# Altium schematic sheet eElements.SchDoc
size A3; SheetNumber: 1; SheetTotal: 1
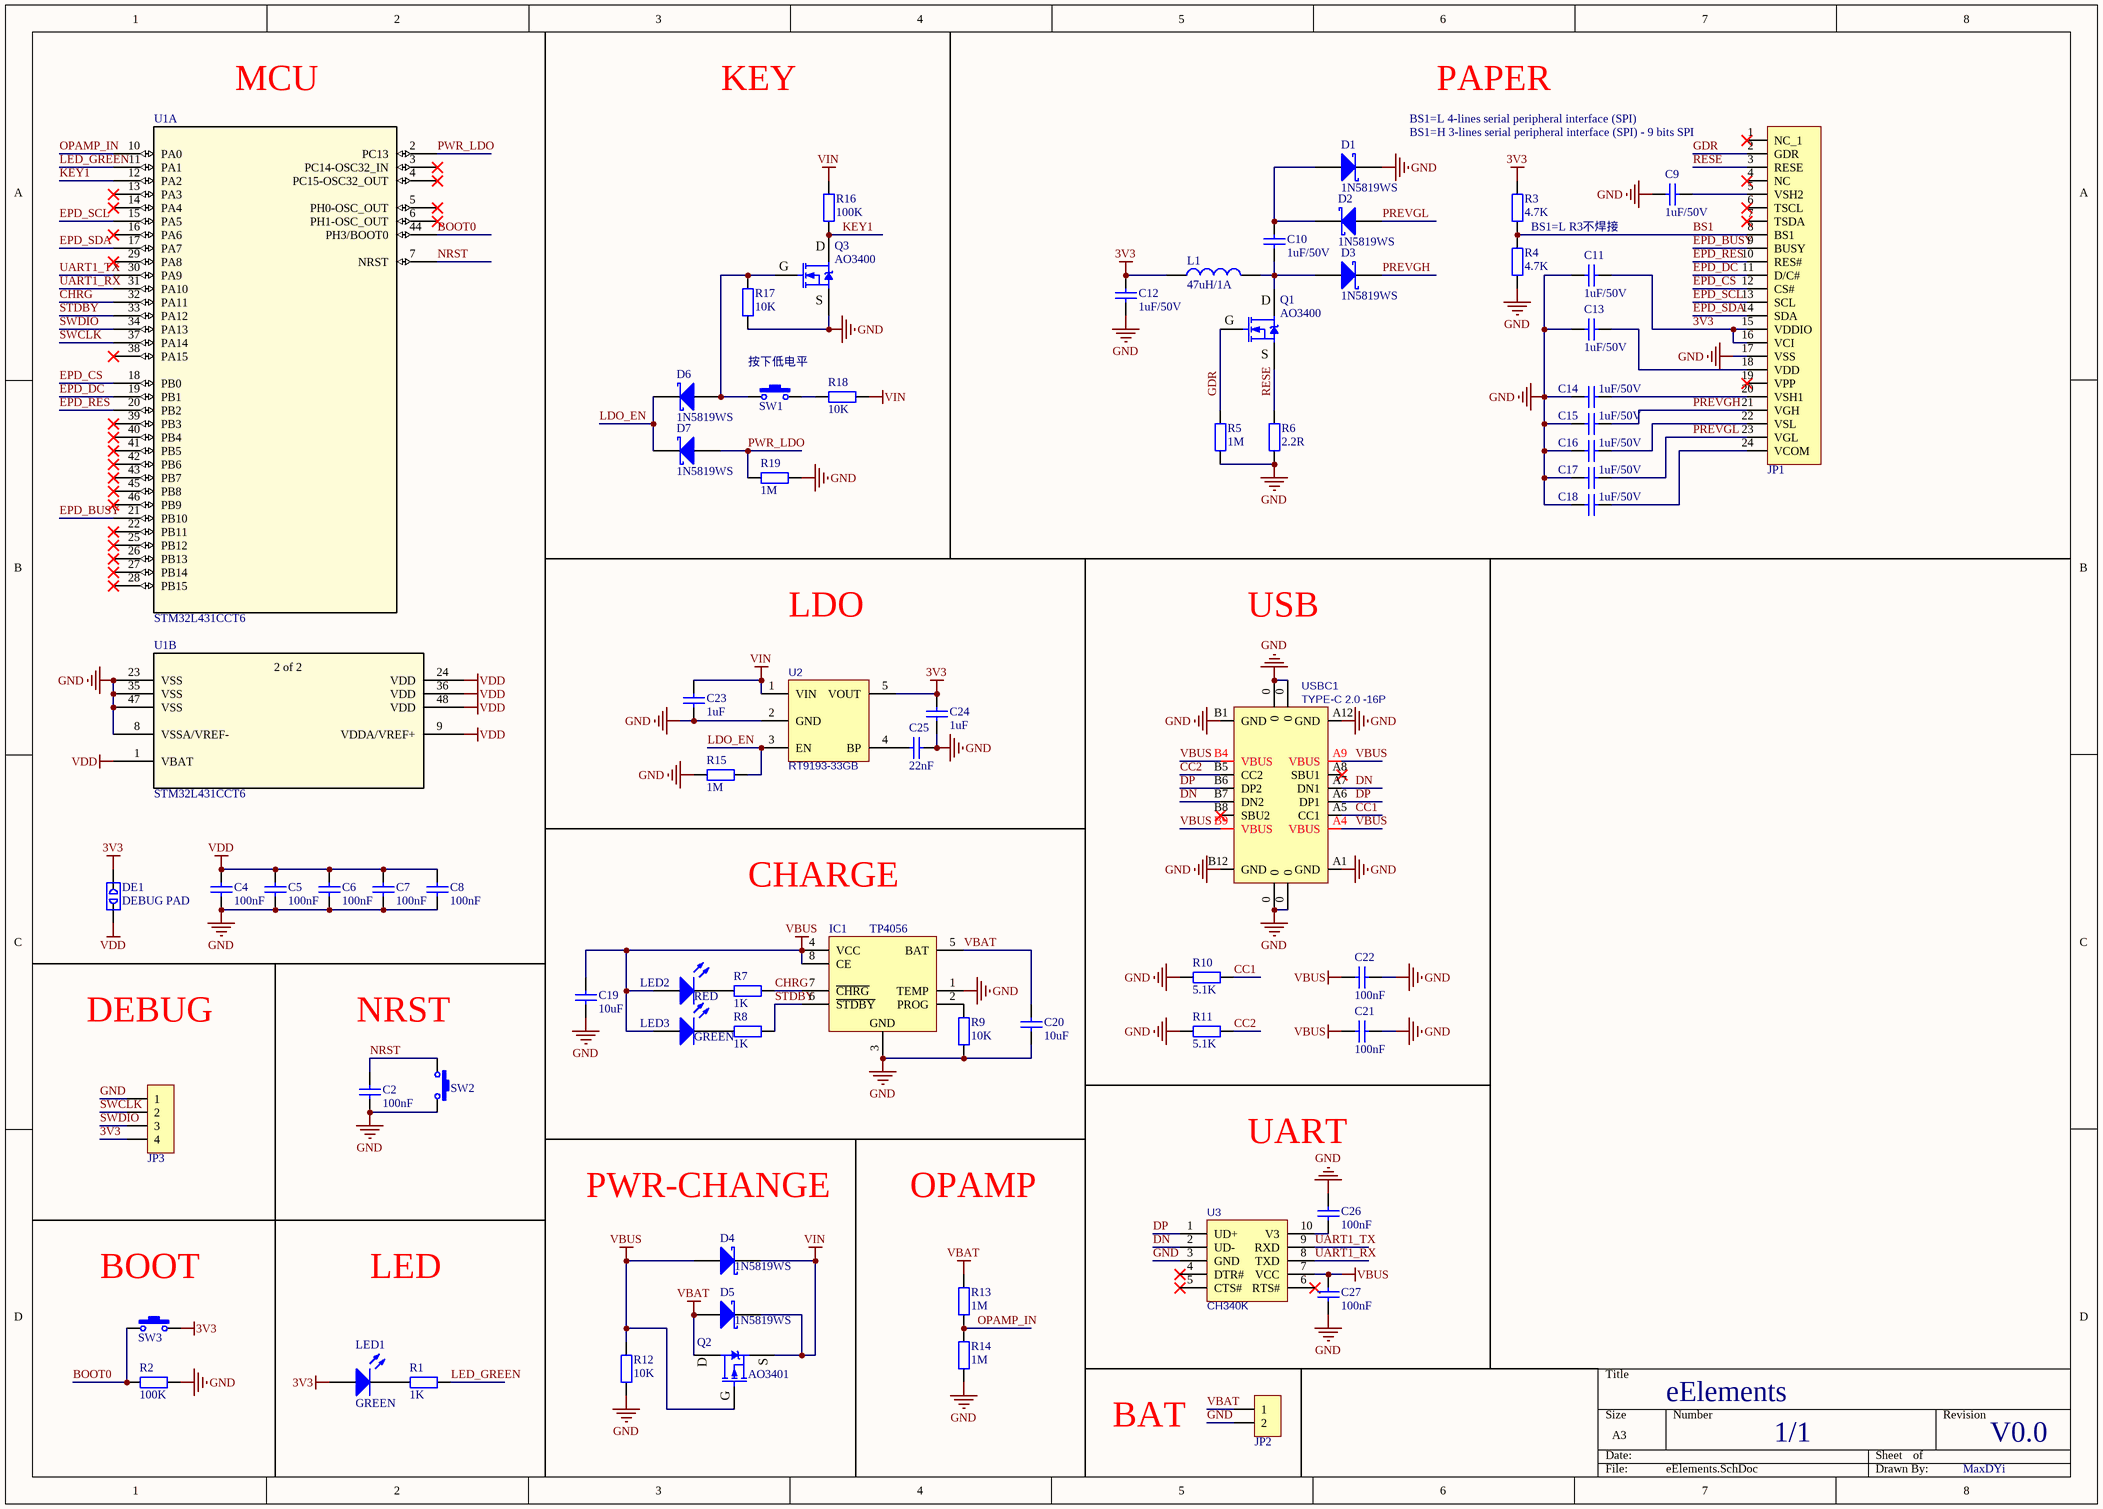
[diagram p0: eElements.SchDoc]

## Parts
C2  100nF  [C0402_M]
C4  100nF  [C0402_M]
C5  100nF  [C0402_M]
C6  100nF  [C0402_M]
C7  100nF  [C0402_M]
C8  100nF  [C0402_M]
C9  1uF/50V  [C0402_M]
C10  1uF/50V  [C0402_M]
C11  1uF/50V  [C0402_M]
C12  1uF/50V  [C0402_M]
C13  1uF/50V  [C0402_M]
C14  1uF/50V  [C0402_M]
C15  1uF/50V  [C0402_M]
C16  1uF/50V  [C0402_M]
C17  1uF/50V  [C0402_M]
C18  1uF/50V  [C0402_M]
C19  10uF  [C0402_M]
C20  10uF  [C0402_M]
C21  100nF  [C0402_M]
C22  100nF  [C0402_M]
C23  1uF  [C0402_M]
C24  1uF  [C0402_M]
C25  22nF  [C0402_M]
C26  100nF  [C0402_M]
C27  100nF  [C0402_M]
D1  1N5819WS  [SOD-323]
D2  1N5819WS  [SOD-323]
D3  1N5819WS  [SOD-323]
D4  1N5819WS  [SOD-323]
D5  1N5819WS  [SOD-323]
D6  1N5819WS  [SOD-323]
D7  1N5819WS  [SOD-323]
DE1  DEBUG PAD  [DEBUG_B]
IC1  TP4056  [SOIC-8_EP]
JP1  CON-24P  [FPC0.5-WT-24P-上接]  (value not drawn)
JP2  HDR-1X2  [MX1.25-W-2P]  (value not drawn)
JP3  HDR-1X4  [HDR1.27-LI-4P]  (value not drawn)
L1  47uH/1A  [SWPA4030]
LED1  GREEN  [LED0603_R]
LED2  RED  [LED0603_R]
LED3  GREEN  [LED0603_R]
Q1  AO3400  [SOT23-3N]
Q2  AO3401  [SOT23-3N]
Q3  AO3400  [SOT23-3N]
R1  1K  [R0402_M]
R2  100K  [R0402_M]
R3  4.7K  [R0402_M]
R4  4.7K  [R0402_M]
R5  1M  [R0402_M]
R6  2.2R  [R0603_M]
R7  1K  [R0402_M]
R8  1K  [R0402_M]
R9  10K  [R0402_M]
R10  5.1K  [R0402_M]
R11  5.1K  [R0402_M]
R12  10K  [R0402_M]
R13  1M  [R0402_M]
R14  1M  [R0402_M]
R15  1M  [R0402_M]
R16  100K  [R0402_M]
R17  10K  [R0402_M]
R18  10K  [R0402_M]
R19  1M  [R0402_M]
SW1  3x6x5  [SW 3*6*4.3-S-W]  (value not drawn)
SW2  3x6x5  [SW SMD-3*6*2.5]  (value not drawn)
SW3  3x6x5  [SW SMD-3*6*2.5]  (value not drawn)
U1  STM32L431CCT6  [LQFP48_M]  (parts A,B of 2)
U2  RT9193-33GB  [SOT-23-5]
U3  CH340K  [SOP10_M]
USBC1  TYPE-C 2.0 -16P  [USB-C-SMD_16P]

## Nets
3V3: C11.2 C12.2 C24.2 DE1.1 JP1.15(VDDIO) JP1.16(VCI) JP3.4 L1.1 LED1.1(A) R3.2 SW3.2 U2.5(VOUT)
GND: C2.1 C4.1 C5.1 C6.1 C7.1 C8.1 C9.1 C11.1 C12.1 C13.1 C14.1 C15.1 C16.1 C17.1 C18.1 C19.1 C20.1 C21.1 C22.1 C23.1 C24.1 C25.1 C26.2 C27.1 D1.2(K) IC1.1(TEMP) IC1.3(GND) JP1.17(VSS) JP2.2 JP3.1 Q3.2(S) R2.2 R4.1 R5.1 R6.1 R9.1 R10.2 R11.2 R12.2 R14.1 R15.2 R17.1 R19.1 SW2.2 U1.8(VSSA/VREF-) U1.23(VSS) U1.35(VSS) U1.47(VSS) U2.2(GND) U3.3(GND) USBC1.0 USBC1.A1(GND) USBC1.A12(GND) USBC1.B1(GND) USBC1.B12(GND)
VBAT: C20.2 D5.1(A) IC1.5(BAT) JP2.1 Q2.3(D) R13.2
VBUS: C19.2 C21.2 C22.2 C27.2 D4.1(A) IC1.4(VCC) IC1.8(CE) LED2.1(A) LED3.1(A) Q2.1(G) R12.1 U3.7(VCC) USBC1.A4(VBUS) USBC1.A9(VBUS) USBC1.B4(VBUS) USBC1.B9(VBUS)
VDD: C4.2 C5.2 C6.2 C7.2 C8.2 DE1.2 U1.1(VBAT) U1.9(VDDA/VREF+) U1.24(VDD) U1.36(VDD) U1.48(VDD)
VIN: C23.2 D4.2(K) D5.2(K) Q2.2(S) R16.2 R18.1 U2.1(VIN)
BOOT0: R2.1 SW3.1 U1.44(PH3/BOOT0)
BS1: JP1.8(BS1) R3.1 R4.2
CC1: R10.1 USBC1.A5(CC1)
CC2: R11.1 USBC1.B5(CC2)
CHRG: IC1.7(~{CHRG}) R7.1 U1.32(PA11)
DN: U3.2(UD-) USBC1.A7(DN1) USBC1.B7(DN2)
DP: U3.1(UD+) USBC1.A6(DP1) USBC1.B6(DP2)
EPD_BUSY: JP1.9(BUSY) U1.21(PB10)
EPD_CS: JP1.12(CS#) U1.18(PB0)
EPD_DC: JP1.11(D/C#) U1.19(PB1)
EPD_RES: JP1.10(RES#) U1.20(PB2)
EPD_SCL: JP1.13(SCL) U1.15(PA5)
EPD_SDA: JP1.14(SDA) U1.17(PA7)
GDR: JP1.2(GDR) Q1.1(G) R5.2
KEY1: Q3.3(D) R16.1 U1.12(PA2)
LDO_EN: D6.2(K) D7.2(K) R15.1 U2.3(EN)
LED_GREEN: R1.1 U1.11(PA1)
NRST: C2.2 SW2.1 U1.7(NRST)
OPAMP_IN: R13.1 R14.2 U1.10(PA0)
PREVGH: C15.2 D3.2(K) JP1.21(VGH)
PREVGL: C17.2 D2.1(A) JP1.23(VGL)
PWR_LDO: D7.1(A) R19.2 U1.2(PC13)
RESE: JP1.3(RESE) Q1.2(S) R6.2
STDBY: IC1.6(~{STDBY}) R8.1 U1.33(PA12)
SWCLK: JP3.2 U1.37(PA14)
SWDIO: JP3.3 U1.34(PA13)
UART1_RX: U1.31(PA10) U3.8(TXD)
UART1_TX: U1.30(PA9) U3.9(RXD)
NetC9_2: C9.2 JP1.5(VSH2)
NetC10_1: C10.1 D3.1(A) L1.2 Q1.3(D)
NetC10_2: C10.2 D1.1(A) D2.2(K)
NetC13_2: C13.2 JP1.18(VDD)
NetC14_2: C14.2 JP1.20(VSH1)
NetC16_2: C16.2 JP1.22(VSL)
NetC18_2: C18.2 JP1.24(VCOM)
NetC25_2: C25.2 U2.4(BP)
NetC26_1: C26.1 U3.10(V3)
NetD6_1: D6.1(A) Q3.1(G) R17.2 SW1.1
NetIC1_2: IC1.2(PROG) R9.2
NetLED1_2: LED1.2(K) R1.2
NetLED2_2: LED2.2(K) R7.2
NetLED3_2: LED3.2(K) R8.2
NetR18_2: R18.2 SW1.2

Not connected (* = marked no-connect by the designer): JP1 1(NC_1)* 4(NC)* 6(TSCL)* 7(TSDA)* 19(VPP)*; U1 3(PC14-OSC32_IN)* 4(PC15-OSC32_OUT)* 5(PH0-OSC_OUT)* 6(PH1-OSC_OUT)* 13(PA3)* 14(PA4)* 16(PA6)* 22(PB11)* 25(PB12)* 26(PB13)* 27(PB14)* 28(PB15)* 29(PA8)* 38(PA15)* 39(PB3)* 40(PB4)* 41(PB5)* 42(PB6)* 43(PB7)* 45(PB8)* 46(PB9)*; U3 4(DTR#)* 5(CTS#)* 6(RTS#)*; USBC1 A8(SBU1)* B8(SBU2)*

## Notes on the sheet
- MCU
- KEY
- PAPER
- BS1=L 4-lines serial peripheral interface (SPI)
- (near JP1) BS1=H 3-lines serial peripheral interface (SPI) - 9 bits SPI
- BS1=L R3不焊接
- 按下低电平
- LDO
- USB
- CHARGE
- DEBUG
- NRST
- UART
- PWR-CHANGE
- OPAMP
- (near SW3) BOOT
- LED
- BAT
- eElements
- 1/1
- V0.0
- MaxDYi
- (in symbol STM32L431CCT6, part B) 2 of 2

## Library data of the parts
C2 C4-C27 = C: 贴片电容/MLCC电容; BOM名称: 无极性贴片电容; 当前库版本V2022.12.25 @淘宝卖家:黄晶宝石: 最新版本发布https://shop463601444.taobao.com
D1-D7 = 1N5819: 肖特基二极管; 当前库版本V2022.12.25 @淘宝卖家:黄晶宝石: 最新版本发布https://shop463601444.taobao.com; BOM名称: 肖特基二极管
DE1 = DEBUG: 调试断点焊盘; 联系下单店铺卖家 免费技术支持: 联系下单店铺卖家 免费帮你查找封装; BOM名称: 调试断点焊盘
IC1 = TP4056: 锂电池充电管理; 当前库版本V2022.12.25 @淘宝卖家:黄晶宝石: 最新版本发布https://shop463601444.taobao.com; BOM名称: 锂电池充电管理
JP1 = EPD-1.54: 2.54寸墨水屏24P连接器（上接点或上下接点24PIN的0.5mmFPC插座）; BOM名称: 1.54寸墨水屏; 封装库来自淘宝卖家：黄晶宝石: 获取最新版本https://shop463601444.taobao.com
JP2 = Header 2: 2P连接器; 联系卖家 免费技术支持: 封装库来自淘宝卖家ID：黄晶宝石; BOM名称: 2P连接器
JP3 = Header 4: 4P连接器; 联系卖家 免费查找封装: 唯一出售店铺网址https://shop463601444.taobao.com; BOM名称: 4P连接器
L1 = L: 贴片小功率电感; BOM名称: 小功率贴片电感; 联系下单店铺卖家 免费帮你查找封装: 联系下单店铺卖家 免费技术支持
LED1-LED3 = LED: 贴片LED; 封装库来自淘宝卖家：黄晶宝石: 其他店铺购入均为盗版封装库，无更新权益，请立即申请退款，本店现金奖励200~1000元; BOM名称: 贴片LED
Q1 Q3 = AO3400: N沟道 30V/4.2A; BOM名称: 场效应管; 联系下单店铺卖家 免费帮你查找封装: 联系下单店铺卖家 免费技术支持; 参数: N沟道 30V/4.2A
Q2 = AO3401: P沟道 30V/4.2A; BOM名称: 场效应管; 联系下单店铺卖家 免费帮你查找封装: 联系下单店铺卖家 免费技术支持; 参数: P沟道 30V/4.2A
R1-R19 = R: 贴片电阻; 联系下单店铺卖家 免费帮你查找封装: 联系下单店铺卖家 免费技术支持; BOM名称: 贴片电阻
SW1-SW3 = SW-PB: 微动开关; BOM名称: 3x6轻触开关; 联系下单店铺卖家 免费技术支持: 联系下单店铺卖家 免费帮你查找封装
U1 = STM32L431CCT6: Ultra-low-power with FPU Arm Cortex-M4 MCU 80 MHz with 256 Kbytes of Flash memory; Mfr_Name: STMicroelectronics; RefDes: RefDes; Type: Type
U2 = RT9193-33GB: LDO 3.3V/0.3A; BOM名称: RT9193-30GB; 当前库版本V2022.12.25 @淘宝卖家:黄晶宝石: 最新版本发布https://shop463601444.taobao.com
U3 = CH340K: USB转串口芯片, 内置晶振; 芯片厂商: WCH(南京沁恒); 封装库来自淘宝卖家：黄晶宝石: 其他店铺购入均为盗版封装库，无更新权益，退款现金奖励200~1000元; 当前库版本V2022.12.25 @淘宝卖家:黄晶宝石: 最新版本发布https://shop463601444.taobao.com
USBC1 = USB2.0_Type-C_16Pin: USB2.0_Type-C_16Pin母座; 当前库版本V2022.12.25 @淘宝卖家:黄晶宝石: 最新版本发布https://shop463601444.taobao.com